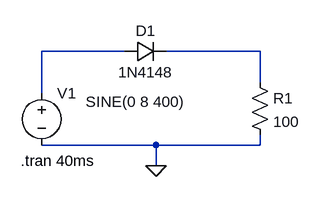
[diagram p0: schematic problem_2.asc]
problem_2.asc, the LTspice schematic file:
Version 4
SHEET 1 880 680
WIRE 112 112 -16 112
WIRE 320 112 176 112
WIRE 320 160 320 112
WIRE -16 176 -16 112
WIRE 160 256 -16 256
WIRE 320 256 320 240
WIRE 320 256 160 256
WIRE 160 288 160 256
FLAG 160 288 0
SYMBOL diode 112 128 R270
WINDOW 0 32 32 VTop 2
WINDOW 3 0 32 VBottom 2
SYMATTR InstName D1
SYMATTR Value 1N4148
SYMBOL res 304 144 R0
SYMATTR InstName R1
SYMATTR Value 100
SYMBOL voltage -16 160 R0
WINDOW 123 24 44 Left 2
WINDOW 39 0 0 Left 2
WINDOW 3 68 29 Left 2
SYMATTR Value SINE(0 8 400)
SYMATTR InstName V1
TEXT -48 280 Left 2 !.tran 40ms

The netlist it stands for:
* problem_2.asc
D1 N001 N002 1N4148
R1 N002 0 100
V1 N001 0 SINE(0 8 400)
.model D D
.lib standard.dio
.tran 40ms
.backanno
.end